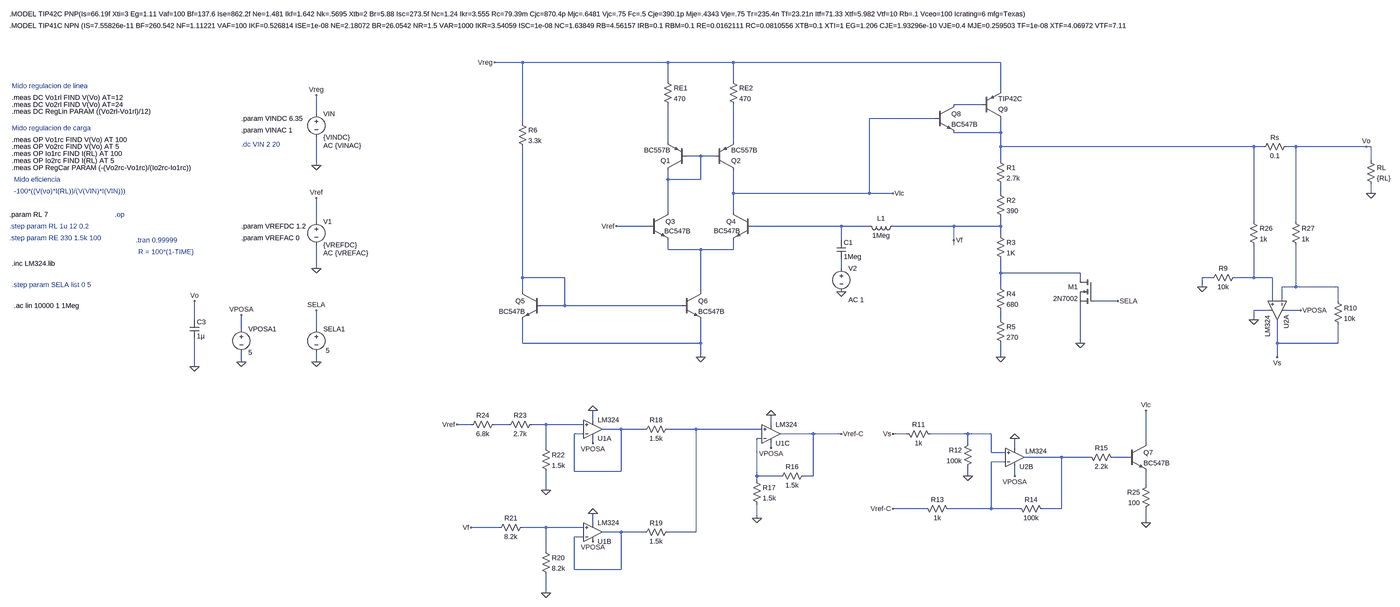
[diagram p0: schematic Simulacion - v9.asc, whole sheet]
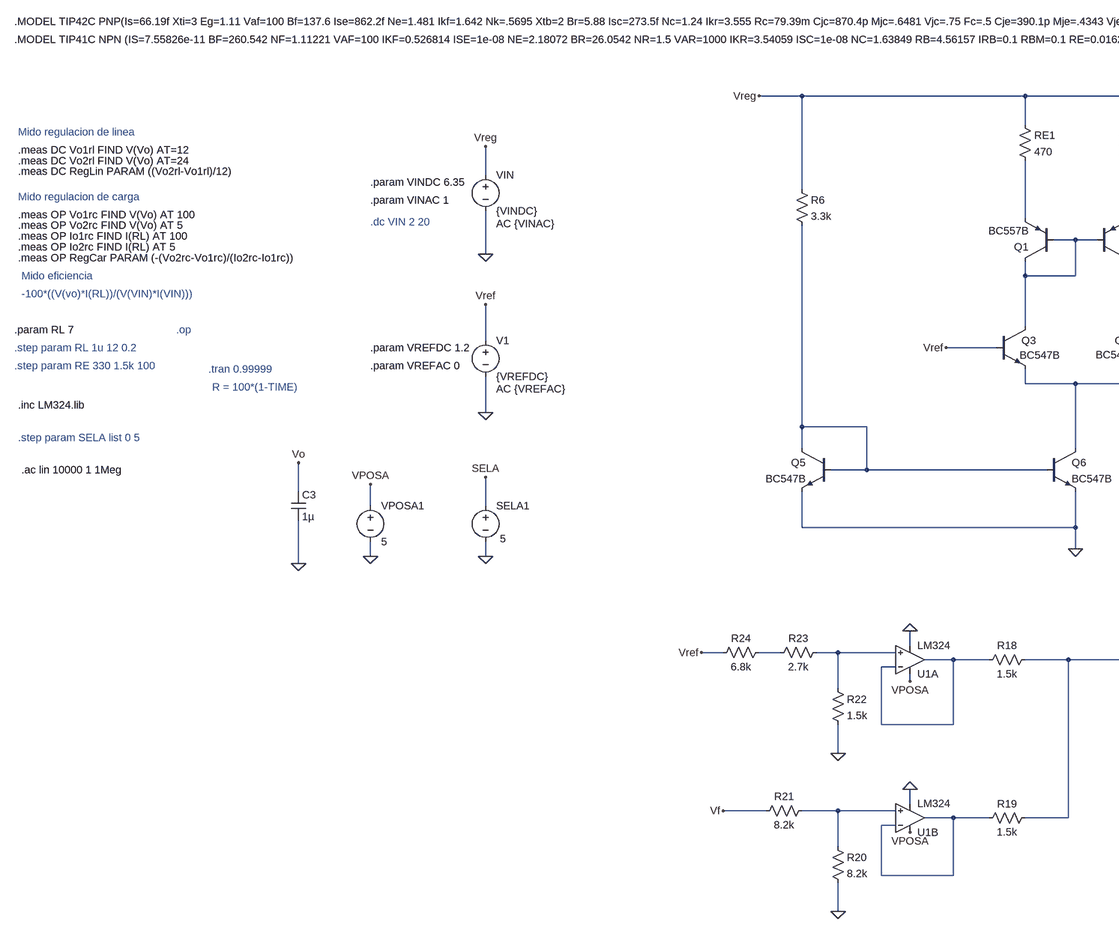
[diagram p1: schematic Simulacion - v9.asc, part, row 1 of 1, column 1 of 2]
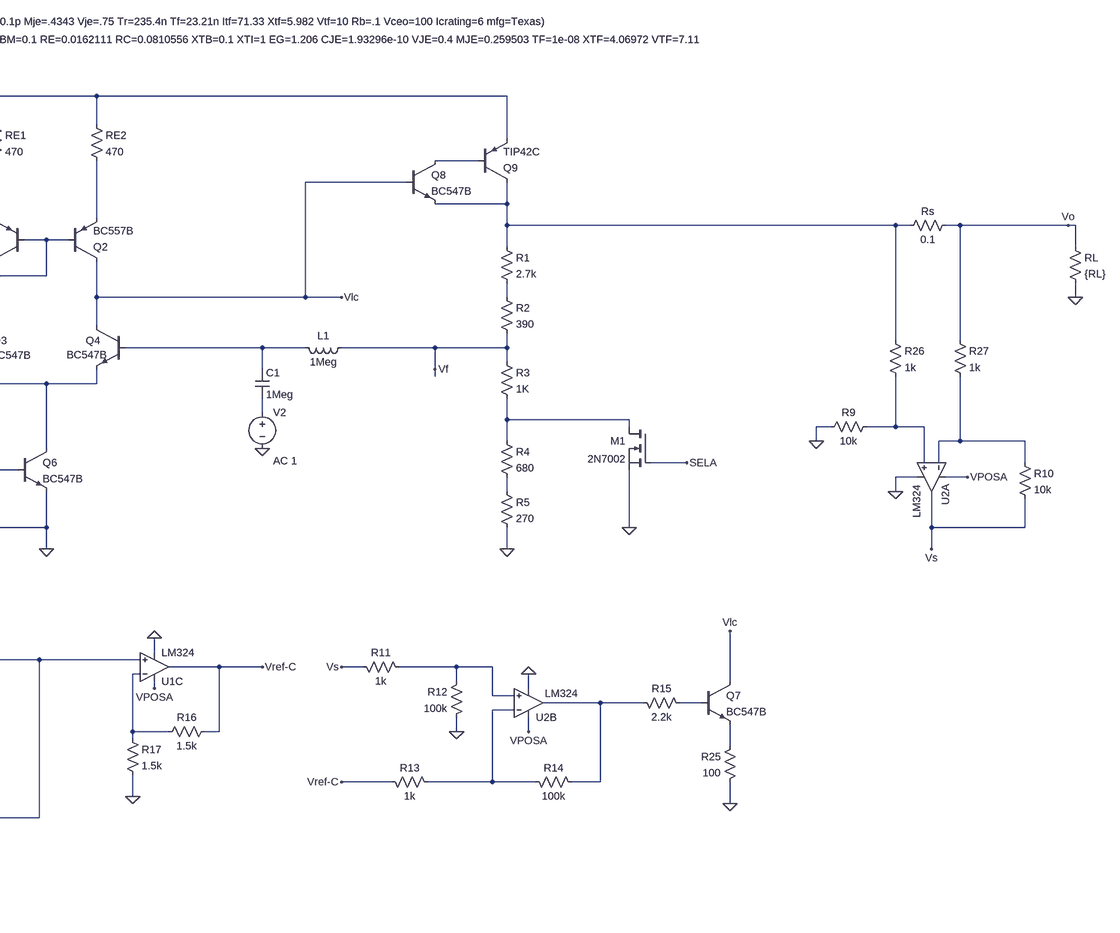
[diagram p2: schematic Simulacion - v9.asc, part, row 1 of 1, column 2 of 2]
Simulacion - v9.asc, the LTspice schematic file:
Version 4
SHEET 1 10276 2748
WIRE -160 -288 -256 -288
WIRE 336 -288 -160 -288
WIRE 560 -288 336 -288
WIRE 1472 -288 560 -288
WIRE 336 -224 336 -288
WIRE 560 -224 560 -288
WIRE 1472 -192 1472 -288
WIRE 1408 -144 1312 -144
WIRE -864 -112 -864 -176
WIRE 1248 -96 1024 -96
WIRE -160 -80 -160 -288
WIRE 1472 -48 1472 -96
WIRE 1472 -48 1312 -48
WIRE 336 -16 336 -144
WIRE 560 -16 560 -144
WIRE 1472 0 1472 -48
WIRE 2336 0 1472 0
WIRE 2368 0 2336 0
WIRE 2480 0 2448 0
WIRE 2720 0 2480 0
WIRE 2736 0 2720 0
WIRE 448 32 400 32
WIRE 496 32 448 32
WIRE 1472 48 1472 0
WIRE 2736 48 2736 0
WIRE -864 64 -864 -32
WIRE 336 112 336 80
WIRE 448 112 448 32
WIRE 448 112 336 112
WIRE 560 160 560 80
WIRE 1024 160 1024 -96
WIRE 1024 160 560 160
WIRE 1104 160 1024 160
WIRE 1472 160 1472 128
WIRE 2736 160 2736 128
WIRE 336 224 336 112
WIRE 560 224 560 160
WIRE -864 256 -864 176
WIRE 2336 256 2336 0
WIRE 2480 256 2480 0
WIRE 272 272 160 272
WIRE 928 272 624 272
WIRE 1024 272 928 272
WIRE 1312 272 1104 272
WIRE 1472 272 1472 240
WIRE 1472 272 1312 272
WIRE 1472 304 1472 272
WIRE 928 320 928 272
WIRE 1312 320 1312 272
WIRE 1312 336 1312 320
WIRE 336 352 336 320
WIRE 448 352 336 352
WIRE 560 352 560 320
WIRE 560 352 448 352
WIRE -864 416 -864 336
WIRE 928 416 928 384
WIRE 1472 432 1472 384
WIRE 1744 432 1472 432
WIRE -160 448 -160 0
WIRE -16 448 -160 448
WIRE 1744 448 1744 432
WIRE 2192 448 2160 448
WIRE 2336 448 2336 336
WIRE 2336 448 2272 448
WIRE 2400 448 2336 448
WIRE 1472 480 1472 432
WIRE 2160 480 2160 448
WIRE 2480 480 2480 336
WIRE 2480 480 2432 480
WIRE 2624 480 2480 480
WIRE -160 496 -160 448
WIRE 448 496 448 352
WIRE 1872 528 1792 528
WIRE 2400 528 2400 448
WIRE 2432 528 2432 480
WIRE 2624 528 2624 480
WIRE -16 544 -16 448
WIRE -16 544 -96 544
WIRE 384 544 -16 544
WIRE 2384 560 2336 560
WIRE 2496 560 2448 560
WIRE -1280 592 -1280 528
WIRE 1472 592 1472 560
WIRE 2336 592 2336 560
WIRE -1120 624 -1120 576
WIRE -864 624 -864 560
WIRE -160 672 -160 592
WIRE 448 672 448 592
WIRE 448 672 -160 672
WIRE 1744 672 1744 544
WIRE 2416 672 2416 592
WIRE 2624 672 2624 608
WIRE 2624 672 2416 672
WIRE 448 720 448 672
WIRE 1472 720 1472 672
WIRE 2416 720 2416 672
WIRE -1120 736 -1120 704
WIRE -864 736 -864 704
WIRE -1280 752 -1280 656
WIRE 80 976 80 944
WIRE -336 992 -384 992
WIRE -208 992 -256 992
WIRE -80 992 -128 992
WIRE 48 992 -80 992
WIRE 688 992 688 960
WIRE 176 1008 112 1008
WIRE 256 1008 176 1008
WIRE 432 1008 336 1008
WIRE 656 1008 432 1008
WIRE 48 1024 16 1024
WIRE 832 1024 720 1024
WIRE 928 1024 832 1024
WIRE 1152 1024 1104 1024
WIRE 1360 1024 1232 1024
WIRE 1440 1024 1360 1024
WIRE 656 1040 640 1040
WIRE 80 1056 80 1040
WIRE 1360 1056 1360 1024
WIRE 1968 1056 1968 944
WIRE -80 1072 -80 992
WIRE 688 1072 688 1056
WIRE 1520 1072 1520 1040
WIRE 1440 1088 1440 1024
WIRE 1488 1088 1440 1088
WIRE 1680 1104 1552 1104
WIRE 1776 1104 1680 1104
WIRE 1904 1104 1856 1104
WIRE 1488 1120 1440 1120
WIRE 16 1152 16 1024
WIRE 176 1152 176 1008
WIRE 176 1152 16 1152
WIRE 640 1168 640 1040
WIRE 720 1168 640 1168
WIRE 832 1168 832 1024
WIRE 832 1168 800 1168
WIRE 1360 1168 1360 1136
WIRE 1520 1168 1520 1136
WIRE 640 1184 640 1168
WIRE 1968 1200 1968 1152
WIRE -80 1216 -80 1152
WIRE 1216 1280 1104 1280
WIRE 1440 1280 1440 1120
WIRE 1440 1280 1296 1280
WIRE 1536 1280 1440 1280
WIRE 1680 1280 1680 1104
WIRE 1680 1280 1616 1280
WIRE 640 1312 640 1264
WIRE 80 1328 80 1296
WIRE 1968 1328 1968 1280
WIRE -240 1344 -336 1344
WIRE -80 1344 -160 1344
WIRE 48 1344 -80 1344
WIRE 176 1360 112 1360
WIRE 256 1360 176 1360
WIRE 432 1360 432 1008
WIRE 432 1360 336 1360
WIRE 48 1376 16 1376
WIRE -80 1424 -80 1344
WIRE 16 1488 16 1376
WIRE 176 1488 176 1360
WIRE 176 1488 16 1488
WIRE -80 1568 -80 1504
FLAG 1312 320 Vf
FLAG 1360 1168 0
FLAG 1968 1328 0
FLAG -864 416 0
FLAG -80 1216 0
FLAG -80 1568 0
FLAG 640 1312 0
FLAG -1280 752 0
FLAG 80 1056 VPOSA
FLAG 688 1072 VPOSA
FLAG 2496 560 VPOSA
FLAG 1520 1168 VPOSA
FLAG 80 1392 VPOSA
FLAG -864 64 0
FLAG 1744 672 0
FLAG 1472 720 0
FLAG -864 736 0
FLAG 448 720 0
FLAG 2720 0 Vo
FLAG -1120 736 0
FLAG -1120 576 VPOSA
FLAG 160 272 Vref
FLAG 2160 480 0
FLAG 80 1296 0
FLAG 80 944 0
FLAG 688 960 0
FLAG 1520 1040 0
FLAG 2336 592 0
FLAG -336 1344 Vf
FLAG -384 992 Vref
FLAG 1104 1280 Vref-C
FLAG 1104 1024 Vs
FLAG 2416 720 Vs
FLAG 1968 944 Vlc
FLAG 1104 160 Vlc
FLAG 928 1024 Vref-C
FLAG -256 -288 Vreg
FLAG -864 -176 Vreg
FLAG -864 176 Vref
FLAG 1872 528 SELA
FLAG -864 560 SELA
FLAG -1280 528 Vo
FLAG 928 496 0
FLAG 2736 160 0
SYMBOL pnp 400 80 R180
SYMATTR InstName Q1
SYMATTR Value BC557B
SYMBOL pnp 496 80 M180
SYMATTR InstName Q2
SYMATTR Value BC557B
SYMBOL npn 272 224 R0
WINDOW 3 52 65 Left 2
SYMATTR Value BC547B
SYMATTR InstName Q3
SYMBOL npn 624 224 M0
WINDOW 3 42 64 Left 2
SYMATTR Value BC547B
SYMATTR InstName Q4
SYMBOL pnp 1408 -96 M180
SYMATTR InstName Q9
SYMATTR Value TIP42C
SYMBOL npn 1248 -144 R0
SYMATTR InstName Q8
SYMATTR Value BC547B
SYMBOL res 1456 144 R0
SYMATTR InstName R2
SYMATTR Value 390
SYMBOL res 1456 288 R0
SYMATTR InstName R3
SYMATTR Value 1K
SYMBOL voltage -864 240 R0
WINDOW 123 24 124 Left 2
WINDOW 39 0 0 Left 0
SYMATTR Value2 AC {VREFAC}
SYMATTR InstName V1
SYMATTR Value {VREFDC}
SYMBOL voltage -864 -128 R0
WINDOW 123 24 124 Left 2
WINDOW 39 0 0 Left 0
SYMATTR Value2 AC {VINAC}
SYMATTR InstName VIN
SYMATTR Value {VINDC}
SYMBOL res 320 -240 R0
SYMATTR InstName RE1
SYMATTR Value 470
SYMBOL res 544 -240 R0
SYMATTR InstName RE2
SYMATTR Value 470
SYMBOL cap -1296 592 R0
SYMATTR InstName C3
SYMATTR Value 1µ
SYMBOL res 2464 -16 R90
WINDOW 0 0 56 VBottom 2
WINDOW 3 32 56 VTop 2
SYMATTR InstName Rs
SYMATTR Value 0.1
SYMBOL res 1136 1008 M90
WINDOW 0 0 56 VBottom 2
WINDOW 3 32 56 VTop 2
SYMATTR InstName R11
SYMATTR Value 1k
SYMBOL res 1200 1264 M90
WINDOW 0 0 56 VBottom 2
WINDOW 3 32 56 VTop 2
SYMATTR InstName R13
SYMATTR Value 1k
SYMBOL res 1376 1040 M0
SYMATTR InstName R12
SYMATTR Value 100k
SYMBOL res 1520 1264 M90
WINDOW 0 0 56 VBottom 2
WINDOW 3 32 56 VTop 2
SYMATTR InstName R14
SYMATTR Value 100k
SYMBOL res 1760 1088 M90
WINDOW 0 0 56 VBottom 2
WINDOW 3 32 56 VTop 2
SYMATTR InstName R15
SYMATTR Value 2.2k
SYMBOL res 1984 1184 M0
SYMATTR InstName R25
SYMATTR Value 100
SYMBOL npn 1904 1056 R0
SYMATTR InstName Q7
SYMATTR Value BC547B
SYMBOL res -240 976 R90
WINDOW 0 0 56 VBottom 2
WINDOW 3 32 56 VTop 2
SYMATTR InstName R24
SYMATTR Value 6.8k
SYMBOL res -96 1056 R0
SYMATTR InstName R22
SYMATTR Value 1.5k
SYMBOL res 352 992 R90
WINDOW 0 0 56 VBottom 2
WINDOW 3 32 56 VTop 2
SYMATTR InstName R18
SYMATTR Value 1.5k
SYMBOL res -144 1328 R90
WINDOW 0 0 56 VBottom 2
WINDOW 3 32 56 VTop 2
SYMATTR InstName R21
SYMATTR Value 8.2k
SYMBOL res -96 1408 R0
SYMATTR InstName R20
SYMATTR Value 8.2k
SYMBOL res 352 1344 R90
WINDOW 0 0 56 VBottom 2
WINDOW 3 32 56 VTop 2
SYMATTR InstName R19
SYMATTR Value 1.5k
SYMBOL res 816 1152 R90
WINDOW 0 0 56 VBottom 2
WINDOW 3 32 56 VTop 2
SYMATTR InstName R16
SYMATTR Value 1.5k
SYMBOL res 624 1168 R0
SYMATTR InstName R17
SYMATTR Value 1.5k
SYMBOL res 1456 464 R0
SYMATTR InstName R4
SYMATTR Value 680
SYMBOL nmos 1792 448 M0
SYMATTR InstName M1
SYMATTR Value 2N7002
SYMBOL voltage -864 608 R0
WINDOW 3 32 89 Left 2
WINDOW 123 0 0 Left 0
WINDOW 39 0 0 Left 0
SYMATTR Value 5
SYMATTR InstName SELA1
SYMBOL npn 384 496 R0
SYMATTR InstName Q6
SYMATTR Value BC547B
SYMBOL npn -96 496 M0
SYMATTR InstName Q5
SYMATTR Value BC547B
SYMBOL res -176 -96 R0
SYMATTR InstName R6
SYMATTR Value 3.3k
SYMBOL res 1456 32 R0
SYMATTR InstName R1
SYMATTR Value 2.7k
SYMBOL OpAmps\\opamp2 2480 560 R90
SYMATTR InstName U2A
SYMATTR Value LM324
SYMBOL OpAmps\\opamp2 1520 1168 M180
WINDOW 3 36 85 Left 2
SYMATTR Value LM324
SYMATTR InstName U2B
SYMBOL OpAmps\\opamp2 80 1072 M180
SYMATTR InstName U1A
SYMATTR Value LM324
SYMBOL OpAmps\\opamp2 688 1088 M180
SYMATTR InstName U1C
SYMATTR Value LM324
SYMBOL voltage -1120 608 R0
WINDOW 123 0 0 Left 0
WINDOW 39 0 0 Left 0
SYMATTR InstName VPOSA1
SYMATTR Value 5
SYMBOL res -112 976 R90
WINDOW 0 0 56 VBottom 2
WINDOW 3 32 56 VTop 2
SYMATTR InstName R23
SYMATTR Value 2.7k
SYMBOL res 2608 512 R0
SYMATTR InstName R10
SYMATTR Value 10k
SYMBOL res 2320 240 R0
SYMATTR InstName R26
SYMATTR Value 1k
SYMBOL res 2464 240 R0
SYMATTR InstName R27
SYMATTR Value 1k
SYMBOL res 2288 432 R90
WINDOW 0 0 56 VBottom 2
WINDOW 3 32 56 VTop 2
SYMATTR InstName R9
SYMATTR Value 10k
SYMBOL res 1456 576 R0
SYMATTR InstName R5
SYMATTR Value 270
SYMBOL OpAmps\\opamp2 80 1424 M180
SYMATTR InstName U1B
SYMATTR Value LM324
SYMBOL cap 912 320 R0
SYMATTR InstName C1
SYMATTR Value 1Meg
SYMBOL voltage 928 400 R0
WINDOW 123 24 124 Left 2
WINDOW 39 0 0 Left 0
SYMATTR Value2 AC 1
SYMATTR InstName V2
SYMATTR Value ""
SYMBOL ind 1120 256 R90
WINDOW 0 5 56 VBottom 2
WINDOW 3 32 56 VTop 2
SYMATTR InstName L1
SYMATTR Value 1Meg
SYMBOL res 2720 32 R0
SYMATTR InstName RL
SYMATTR Value {RL}
TEXT -1552 232 Left 2 ;.op
TEXT -1120 -96 Left 2 !.param VINDC 6.35
TEXT -1120 -56 Left 2 !.param VINAC 1
TEXT -1120 272 Left 2 !.param VREFDC 1.2
TEXT -1120 312 Left 2 !.param VREFAC 0
TEXT -1912 232 Left 2 !.param RL 7
TEXT -1120 -8 Left 2 ;.dc VIN 2 20
TEXT -1912 312 Left 2 ;.step param RE 330 1.5k 100
TEXT -1912 272 Left 2 ;.step param RL 1u 12 0.2
TEXT -1904 -208 Left 2 ;Mido regulacion de linea
TEXT -1904 -168 Left 2 !.meas DC Vo1rl FIND V(Vo) AT=12
TEXT -1904 -144 Left 2 !.meas DC Vo2rl FIND V(Vo) AT=24
TEXT -1904 -120 Left 2 !.meas DC RegLin PARAM ((Vo2rl-Vo1rl)/12)
TEXT -1904 -64 Left 2 ;Mido regulacion de carga
TEXT -1904 -24 Left 2 !.meas OP Vo1rc FIND V(Vo) AT 100
TEXT -1904 0 Left 2 !.meas OP Vo2rc FIND V(Vo) AT 5
TEXT -1904 24 Left 2 !.meas OP Io1rc FIND I(RL) AT 100
TEXT -1904 48 Left 2 !.meas OP Io2rc FIND I(RL) AT 5
TEXT -1896 112 Left 2 ;Mido eficiencia
TEXT -1896 152 Left 2 ;-100*((V(vo)*I(RL))/(V(VIN)*I(VIN)))
TEXT -1904 72 Left 2 !.meas OP RegCar PARAM (-(Vo2rc-Vo1rc)/(Io2rc-Io1rc))
TEXT -1912 -544 Left 2 !.MODEL TIP42C PNP(Is=66.19f Xti=3 Eg=1.11 Vaf=100 Bf=137.6 Ise=862.2f Ne=1.481 Ikf=1.642 Nk=.5695 Xtb=2 Br=5.88 Isc=273.5f Nc=1.24 Ikr=3.555 Rc=79.39m Cjc=870.4p Mjc=.6481 Vjc=.75 Fc=.5 Cje=390.1p Mje=.4343 Vje=.75 Tr=235.4n Tf=23.21n Itf=71.33 Xtf=5.982 Vtf=10 Rb=.1 Vceo=100 Icrating=6 mfg=Texas)
TEXT -1912 -504 Left 2 !.MODEL TIP41C NPN (IS=7.55826e-11 BF=260.542 NF=1.11221 VAF=100 IKF=0.526814 ISE=1e-08 NE=2.18072 BR=26.0542 NR=1.5 VAR=1000 IKR=3.54059 ISC=1e-08 NC=1.63849 RB=4.56157 IRB=0.1 RBM=0.1 RE=0.0162111 RC=0.0810556 XTB=0.1 XTI=1 EG=1.206 CJE=1.93296e-10 VJE=0.4 MJE=0.259503 TF=1e-08 XTF=4.06972 VTF=7.1157 ITF=0.001 CJC=1.09657e-10 VJC=0.730921 MJC=0.23 XCJC=0.803085 FC=0.8 TR=9.01013e-08 PTF=0 Vceo=100 ICrating=6 mfg=ON_Semi)
TEXT -1904 400 Left 2 !.inc LM324.lib
TEXT -1480 320 Left 2 ;.tran 0.99999
TEXT -1472 360 Left 2 ;R = 100*(1-TIME)
TEXT -1904 472 Left 2 ;.step param SELA list 0 5
TEXT -1896 544 Left 2 !.ac lin 10000 1 1Meg

The netlist it stands for:
* Simulacion - v9.asc
Q1 N005 N005 N003 0 BC557B
Q2 Vlc N005 N004 0 BC557B
Q3 N005 Vref N008 0 BC547B
Q4 Vlc N007 N008 0 BC547B
Q9 N002 N001 Vreg 0 TIP42C
Q8 N001 Vlc N002 0 BC547B
R2 N006 Vf 390
R3 Vf N010 1K
V1 Vref 0 {VREFDC} AC {VREFAC}
VIN Vreg 0 {VINDC} AC {VINAC}
RE1 Vreg N003 470
RE2 Vreg N004 470
C3 Vo 0 1µ
Rs Vo N002 0.1
R11 Vs N019 1k
R13 Vref-C N023 1k
R12 N019 0 100k
R14 N023 N021 100k
R15 N021 N022 2.2k
R25 N024 0 100
Q7 Vlc N022 N024 0 BC547B
R24 N015 Vref 6.8k
R22 N016 0 1.5k
R18 N018 N017 1.5k
R21 N025 Vf 8.2k
R20 N025 0 8.2k
R19 N018 N026 1.5k
R16 Vref-C N020 1.5k
R17 N020 0 1.5k
R4 N010 N014 680
M1 N010 SELA 0 0 2N7002
V§SELA1 SELA 0 5
Q6 N008 N011 0 0 BC547B
Q5 N011 N011 0 0 BC547B
R6 Vreg N011 3.3k
R1 N002 N006 2.7k
XU2A N012 N013 VPOSA 0 Vs LM324  ; pins In+ In- V+ V- OUT
XU2B N019 N023 VPOSA 0 N021 LM324  ; pins In+ In- V+ V- OUT
XU1A N016 N017 VPOSA 0 N017 LM324  ; pins In+ In- V+ V- OUT
XU1C N018 N020 VPOSA 0 Vref-C LM324  ; pins In+ In- V+ V- OUT
VPOSA1 VPOSA 0 5
R23 N016 N015 2.7k
R10 N013 Vs 10k
R26 N002 N012 1k
R27 Vo N013 1k
R9 N012 0 10k
R5 N014 0 270
XU1B N025 N026 VPOSA 0 N026 LM324  ; pins In+ In- V+ V- OUT
C1 N007 N009 1Meg
V2 N009 0 AC 1
L1 Vf N007 1Meg
RL Vo 0 {RL}
.model NPN NPN
.model PNP PNP
.lib standard.bjt
.model NMOS NMOS
.model PMOS PMOS
.lib standard.mos
* .op
.param VINDC 6.35
.param VINAC 1
.param VREFDC 1.2
.param VREFAC 0
.param RL 7
* .dc VIN 2 20
* .step param RE 330 1.5k 100
* .step param RL 1u 12 0.2
* Mido regulacion de linea
.meas DC Vo1rl FIND V(Vo) AT=12
.meas DC Vo2rl FIND V(Vo) AT=24
.meas DC RegLin PARAM ((Vo2rl-Vo1rl)/12)
* Mido regulacion de carga
.meas OP Vo1rc FIND V(Vo) AT 100
.meas OP Vo2rc FIND V(Vo) AT 5
.meas OP Io1rc FIND I(RL) AT 100
.meas OP Io2rc FIND I(RL) AT 5
* Mido eficiencia
* -100*((V(vo)*I(RL))/(V(VIN)*I(VIN)))
.meas OP RegCar PARAM (-(Vo2rc-Vo1rc)/(Io2rc-Io1rc))
.MODEL TIP42C PNP(Is=66.19f Xti=3 Eg=1.11 Vaf=100 Bf=137.6 Ise=862.2f Ne=1.481 Ikf=1.642 Nk=.5695 Xtb=2 Br=5.88 Isc=273.5f Nc=1.24 Ikr=3.555 Rc=79.39m Cjc=870.4p Mjc=.6481 Vjc=.75 Fc=.5 Cje=390.1p Mje=.4343 Vje=.75 Tr=235.4n Tf=23.21n Itf=71.33 Xtf=5.982 Vtf=10 Rb=.1 Vceo=100 Icrating=6 mfg=Texas)
.MODEL TIP41C NPN (IS=7.55826e-11 BF=260.542 NF=1.11221 VAF=100 IKF=0.526814 ISE=1e-08 NE=2.18072 BR=26.0542 NR=1.5 VAR=1000 IKR=3.54059 ISC=1e-08 NC=1.63849 RB=4.56157 IRB=0.1 RBM=0.1 RE=0.0162111 RC=0.0810556 XTB=0.1 XTI=1 EG=1.206 CJE=1.93296e-10 VJE=0.4 MJE=0.259503 TF=1e-08 XTF=4.06972 VTF=7.1157 ITF=0.001 CJC=1.09657e-10 VJC=0.730921 MJC=0.23 XCJC=0.803085 FC=0.8 TR=9.01013e-08 PTF=0 Vceo=100 ICrating=6 mfg=ON_Semi)
.inc LM324.lib
* .tran 0.99999
* R = 100*(1-TIME)
* .step param SELA list 0 5
.ac lin 10000 1 1Meg
.backanno
.end